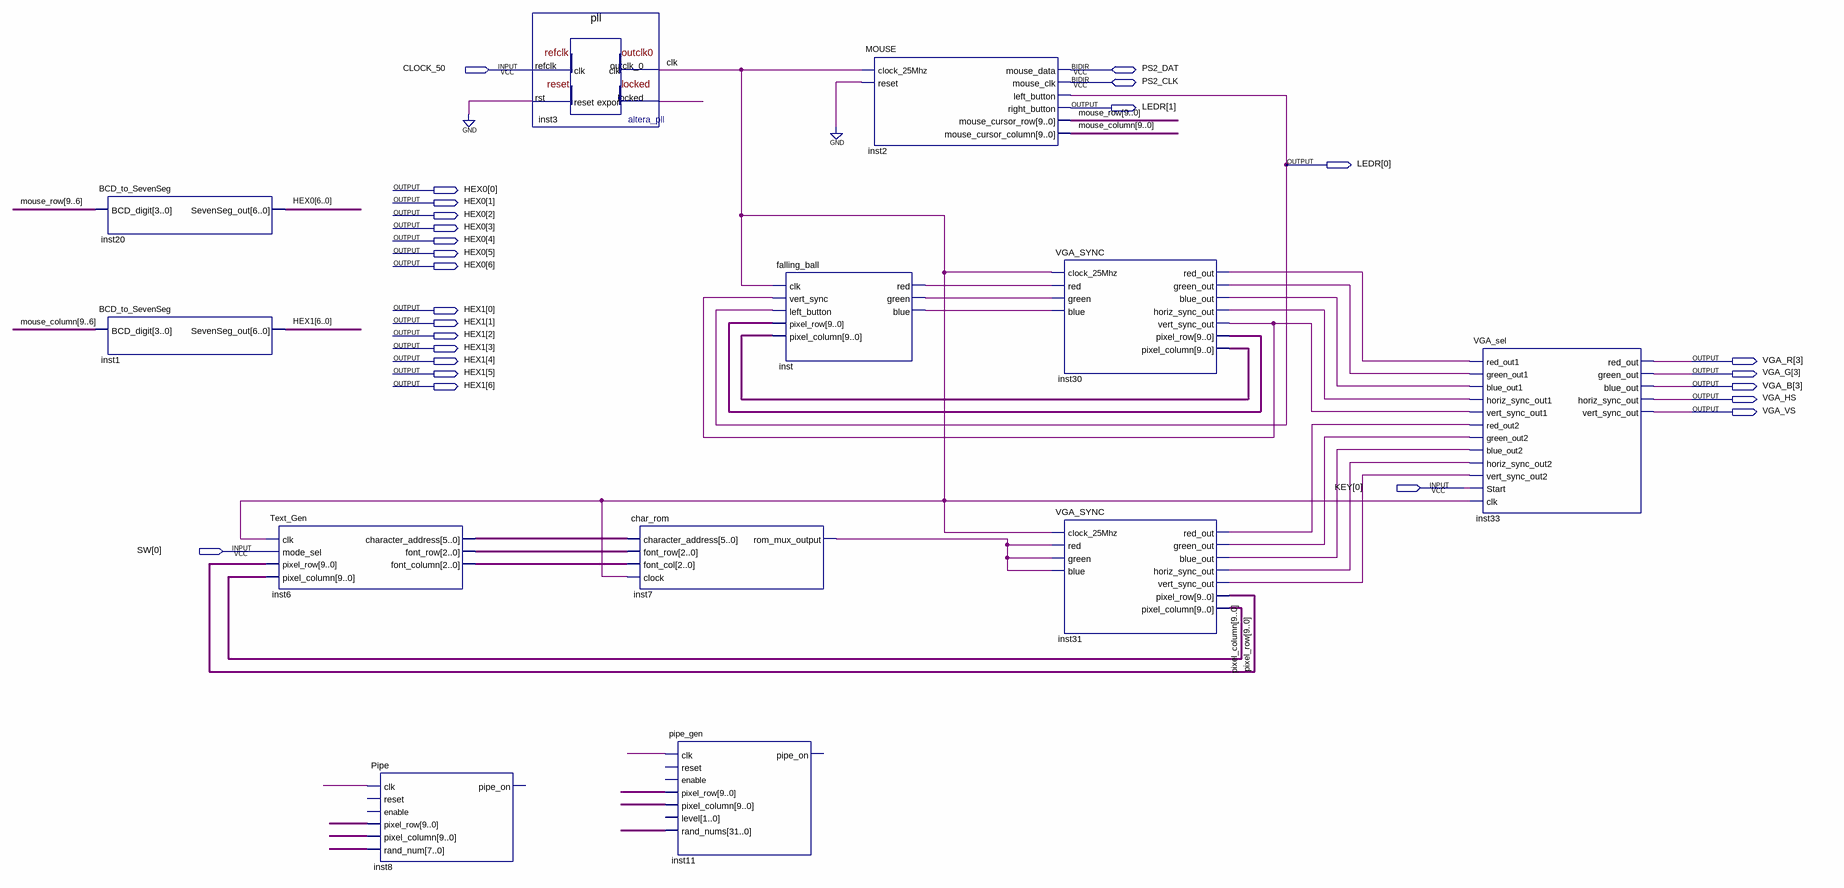
[diagram p0: schematic sheet]
// Quartus schematic Mini_Project_Mouse.bdf as structural Verilog: 12 symbols, 26 pins
module Mini_Project_Mouse (
  input  CLOCK_50,
  input  [0:0] KEY,
  input  [0:0] SW,
  inout  PS2_DAT,
  inout  PS2_CLK,
  output [1:0] LEDR,
  output [6:0] HEX0,
  output [6:0] HEX1,
  output [3:3] VGA_R,
  output [3:3] VGA_G,
  output [3:3] VGA_B,
  output VGA_HS,
  output VGA_VS
);

  wire clk, inst3_locked, inst7_rom_mux_output, inst30_blue_out, inst30_green_out, inst30_horiz_sync_out,
       inst30_red_out, inst30_vert_sync_out, inst31_blue_out, inst31_green_out, inst31_horiz_sync_out,
       inst31_red_out, inst31_vert_sync_out, inst_blue, inst_green, inst_red, undriven, undriven_2;
  wire [2:0] inst6_font_column, inst6_font_row;
  wire [5:0] inst6_character_address;
  wire [7:0] undriven_7;
  wire [9:0] inst30_pixel_column, inst30_pixel_row, mouse_column, mouse_row, pixel_column, pixel_row,
       undriven_3, undriven_4, undriven_5, undriven_6;
  wire [31:0] undriven_8;

  BCD_to_SevenSeg inst20 (.BCD_digit(mouse_row[9:6]), .SevenSeg_out(HEX0));
  BCD_to_SevenSeg inst1 (.BCD_digit(mouse_column[9:6]), .SevenSeg_out(HEX1));
  Text_Gen inst6 (
    .clk(clk), .mode_sel(SW[0]), .pixel_row(pixel_row), .pixel_column(pixel_column),
    .character_address(inst6_character_address), .font_row(inst6_font_row), .font_column(inst6_font_column));
  Pipe inst8 (
    .clk(undriven), .pixel_row(undriven_5), .pixel_column(undriven_6), .rand_num(undriven_7));  // open: reset, enable, pipe_on
  pll inst3 (.refclk(CLOCK_50), .rst(1'b0), .outclk_0(clk), .locked(inst3_locked));
  char_rom inst7 (
    .character_address(inst6_character_address), .font_row(inst6_font_row), .font_col(inst6_font_column),
    .clock(clk), .rom_mux_output(inst7_rom_mux_output));
  pipe_gen inst11 (
    .clk(undriven_2), .pixel_row(undriven_3), .pixel_column(undriven_4), .rand_nums(undriven_8));  // open: reset, enable, level, pipe_on
  falling_ball inst (
    .clk(clk), .vert_sync(inst30_vert_sync_out), .left_button(LEDR[0]), .pixel_row(inst30_pixel_row),
    .pixel_column(inst30_pixel_column), .red(inst_red), .green(inst_green), .blue(inst_blue));
  MOUSE inst2 (
    .clock_25Mhz(clk), .reset(1'b0), .left_button(LEDR[0]), .right_button(LEDR[1]),
    .mouse_cursor_row(mouse_row), .mouse_cursor_column(mouse_column), .mouse_data(PS2_DAT),
    .mouse_clk(PS2_CLK));
  VGA_SYNC inst30 (
    .clock_25Mhz(clk), .red(inst_red), .green(inst_green), .blue(inst_blue), .red_out(inst30_red_out),
    .green_out(inst30_green_out), .blue_out(inst30_blue_out), .horiz_sync_out(inst30_horiz_sync_out),
    .vert_sync_out(inst30_vert_sync_out), .pixel_row(inst30_pixel_row), .pixel_column(inst30_pixel_column));
  VGA_SYNC inst31 (
    .clock_25Mhz(clk), .red(inst7_rom_mux_output), .green(inst7_rom_mux_output), .blue(inst7_rom_mux_output),
    .red_out(inst31_red_out), .green_out(inst31_green_out), .blue_out(inst31_blue_out),
    .horiz_sync_out(inst31_horiz_sync_out), .vert_sync_out(inst31_vert_sync_out), .pixel_row(pixel_row),
    .pixel_column(pixel_column));
  VGA_sel inst33 (
    .red_out1(inst30_red_out), .green_out1(inst30_green_out), .blue_out1(inst30_blue_out),
    .horiz_sync_out1(inst30_horiz_sync_out), .vert_sync_out1(inst30_vert_sync_out),
    .red_out2(inst31_red_out), .green_out2(inst31_green_out), .blue_out2(inst31_blue_out),
    .horiz_sync_out2(inst31_horiz_sync_out), .vert_sync_out2(inst31_vert_sync_out), .Start(KEY[0]),
    .clk(clk), .red_out(VGA_R[3]), .green_out(VGA_G[3]), .blue_out(VGA_B[3]), .horiz_sync_out(VGA_HS),
    .vert_sync_out(VGA_VS));
endmodule
